# EAGLE design adapter (EAGLE 8.0.1)
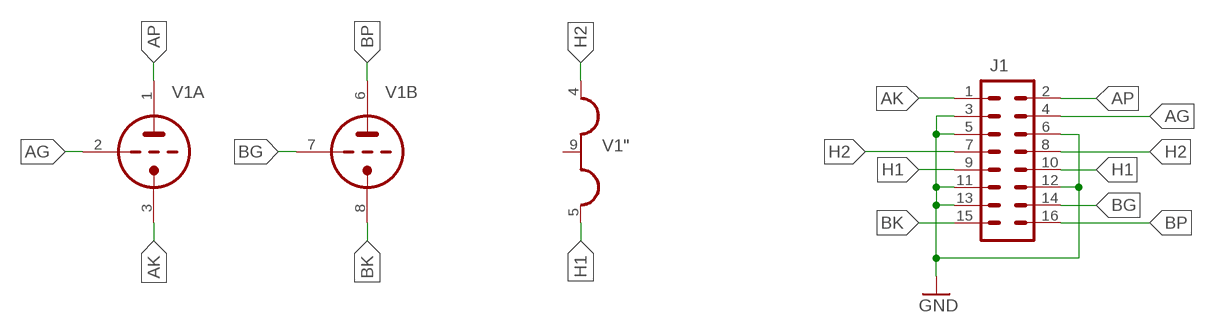
[diagram p0: schematic, sheet 1]

## Parts
J1  M08X2  [2X8]
V1  6DJ8-P18MM-BASE  [NOVAL-18MM]

## Nets
AG: J1.4 V1.2(A:TG)
AK: J1.1 V1.3(A:TK)
AP: J1.2 V1.1(A:TA)
BG: J1.14 V1.7(B:TG)
BK: J1.15 V1.8(B:TK)
BP: J1.16 V1.6(B:TA)
GND: J1.3 J1.5 J1.6 J1.11 J1.12 J1.13
H1: J1.9 J1.10 V1.5(":H3)
H2: J1.7 J1.8 V1.4(":H1)
Unconnected: V1.9(":H2)

## Library data of the parts
J1 = SparkFun-Connectors:M08X2: .1" headers, two rows of 8 each
V1 = my-tubes:6DJ8-P

## Board
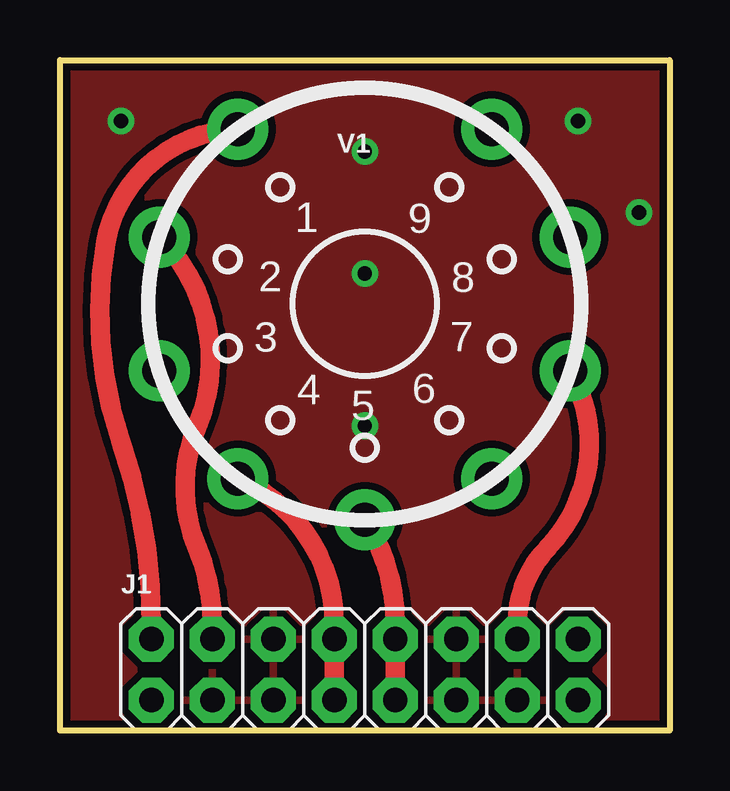
[diagram p1: board, top side]
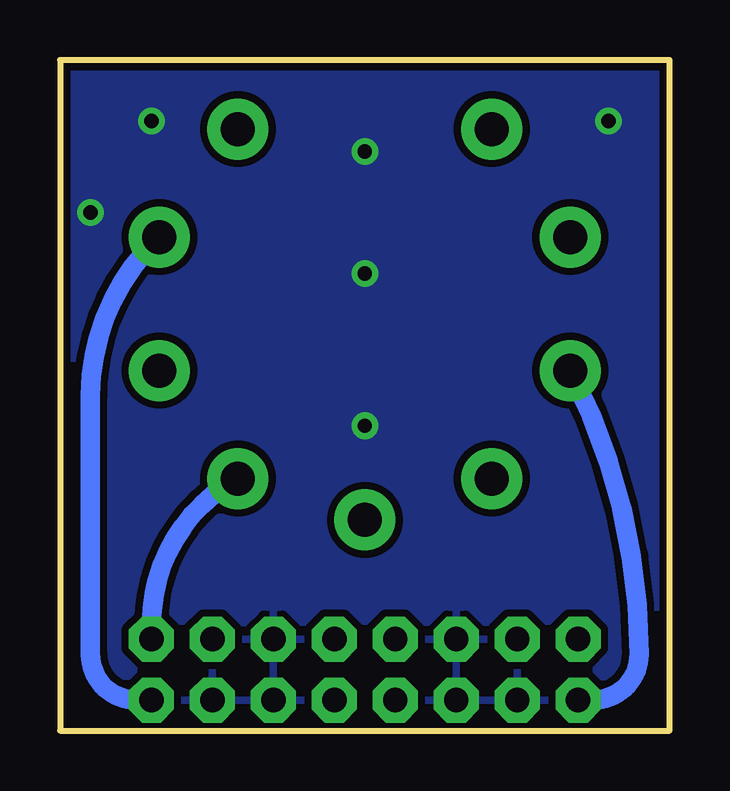
[diagram p2: board, bottom side, seen from below]

Size 25.4 x 27.94 mm. Coordinates in mm from the lower left corner, seen from the top.
Outline: 0,0 0,27.94 25.4,27.94 25.4,0 0,0
Copper layers (1*16): Top 0.035mm / dielectric 1.5mm / Bottom 0.035mm
Design rules "SeeedStudio_2layer_DRU_no_angle_20140221 *": minimum track width 6mil, minimum drill 12mil, track to track 12mil, track to pad 12mil, pad to pad 12mil, via to via 12mil, smd to smd 0mil, copper to edge 12mil, drill to drill 12mil, minimum pad ring 10mil, minimum via ring 10mil, stop-mask expansion 2mil, vias tented up to drill 100mil, thermal gap 10mil
tKeepout: area 1.7,6.8 to 23.7,28.8

### Footprints (pad centres in the part's own frame; a part is rotated, then mirrored left to right if it is on the bottom)
2X8 = drill 1.016 pad 1.88 octagon: 1 0,0; 2 0,2.54; 3 2.54,0; 4 2.54,2.54; 5 5.08,0; 6 5.08,2.54; 7 7.62,0; 8 7.62,2.54; 9 10.16,0; 10 10.16,2.54; 11 12.7,0; 12 12.7,2.54; 13 15.24,0; 14 15.24,2.54; 15 17.78,0; 16 17.78,2.54
NOVAL-18MM = drill 1.422 pad 2.54: 1 5.29,-7.281; 2 8.56,-2.781; 3 8.56,2.781; 4 5.29,7.281; 5 0,9; 6 -5.29,7.281; 7 -8.56,2.781; 8 -8.56,-2.781; 9 -5.29,-7.281

### Placement (x,y rotation side)
J1  3.81,1.27 0 top
V1  12.7,17.78 180 top

### Tracks (layer width: path | path; a pad name or v marks a point on that pad's centre or on a via)
AG
  Top 0.813: J1.4 6.35,4.45 arc23 5.71,7.62 arc-45 5.71,12.7 arc68 V1.2
AK
  Bottom 0.813: J1.1 3.17,1.27 arc-90 1.27,3.17 arc-27 V1.3
AP
  Top 0.813: J1.2 3.81,4.45 arc19 2.54,12.06 arc-29 1.91,20.32 arc-78 V1.1
BG
  Top 0.813: J1.14 19.05,4.45 arc-44 20.32,7.62 arc73 V1.7
BK
  Bottom 0.813: J1.15 22.23,1.27 arc90 24.13,3.17 24.13,13.97 arc47 V1.8
BP
  Bottom 0.813: J1.16 21.59,4.45 arc61 V1.6
GND  (via drill 0.6)
  other vias: 2.54,25.4 12.7,24.13 21.59,25.4 12.7,19.05 24.13,21.59 12.7,12.7
  pour Top: 0,27.94 25.4,27.94 25.4,0 0,0
  pour Bottom: 0,27.94 25.4,27.94 25.4,0 0,0
H1
  Top 0.813: V1.5 arc-33 13.97,4.45 J1.10 J1.9
H2
  Top 0.813: V1.4 arc-67 11.43,4.45 J1.8 J1.7